# EAGLE design mostekH (EAGLE 6.3)
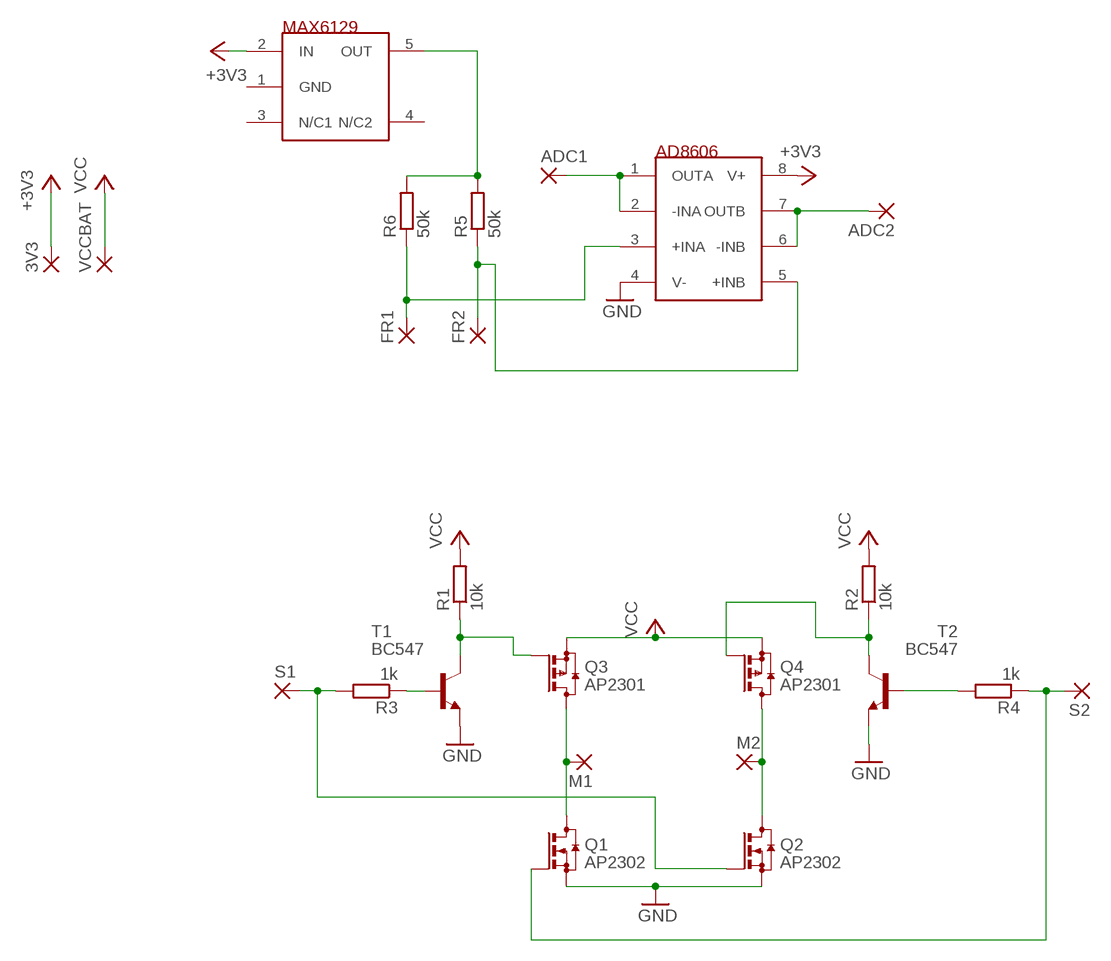
[diagram p0: schematic, sheet 1]

## Parts
3V3  2,54/0,8  [2,54/0,8]
ADC1  2,54/0,8  [2,54/0,8]
ADC2  2,54/0,8  [2,54/0,8]
FR1  2,54/0,8  [2,54/0,8]
FR2  2,54/0,8  [2,54/0,8]
M1  2,54/0,8  [2,54/0,8]
M2  2,54/0,8  [2,54/0,8]
Q1  AP2302  BSS123  [SOT23]
Q2  AP2302  BSS123  [SOT23]
Q3  AP2301  BSS84  [SOT23]
Q4  AP2301  BSS84  [SOT23]
R1  10k  R-EU_M0805  [M0805]
R2  10k  R-EU_M0805  [M0805]
R3  1k  R-EU_M0805  [M0805]
R4  1k  R-EU_M0805  [M0805]
R5  50k  R-EU_M0805  [M0805]
R6  50k  R-EU_M0805  [M0805]
S1  2,54/0,8  [2,54/0,8]
S2  2,54/0,8  [2,54/0,8]
T1  BC547  [TO92]
T2  BC547  [TO92]
U$1  AD8606  [SOIC8]
U$2  MAX6129  [SOT23-5L]
VCCBAT  2,54/0,8  [2,54/0,8]

## Nets
+3V3: 3V3.1(P) U$1.8(V+) U$2.2(IN)
GND: Q1.2(S) Q2.2(S) T1.1(E) T2.1(E) U$1.4(V-)
N$1: M1.1(P) Q1.3(D) Q3.3(D)
N$2: M2.1(P) Q2.3(D) Q4.3(D)
N$3: Q3.1(G) R1.1 T1.3(C)
N$4: Q4.1(G) R2.1 T2.3(C)
N$5: R4.2 T2.2(B)
N$6: FR1.1(P) R6.1 U$1.3(+INA)
N$7: Q2.1(G) R3.2 S1.1(P)
N$8: FR2.1(P) R5.1 U$1.5(+INB)
N$9: Q1.1(G) R4.1 S2.1(P)
N$10: R3.1 T1.2(B)
N$11: ADC1.1(P) U$1.1(OUTA) U$1.2(-INA)
N$12: ADC2.1(P) U$1.6(-INB) U$1.7(OUTB)
N$13: R5.2 R6.2 U$2.5(OUT)
VCC: Q3.2(S) Q4.2(S) R1.2 R2.2 VCCBAT.1(P)
Unconnected: U$2.1(GND) U$2.3(N/C1) U$2.4(N/C2)

## Library data of the parts
3V3 ADC1 ADC2 FR1 FR2 M1 M2 S1 S2 VCCBAT = wirepad:2,54/0,8: THROUGH-HOLE PAD
Q1 Q2 = transistor-small-signal:BSS123: N-CHANNEL MOS FET
Q3 Q4 = transistor-small-signal:BSS84: P-CHANNEL MOS FET
R1-R6 = rcl:R-EU_: RESISTOR, European symbol
T1 T2 = transistor:BC547: NPN TRANSISTOR
U$1 = ref-packages:AD8606: Dual, Precision, Low Noise, CMOS, Rail-to-Rail, Input/Output Operational Amplifiers Single-supply operation: 2.7 V to 5.5
U$2 = ref-packages:MAX6129

## Net classes
0 default: clearance 0.7 mm

## Board
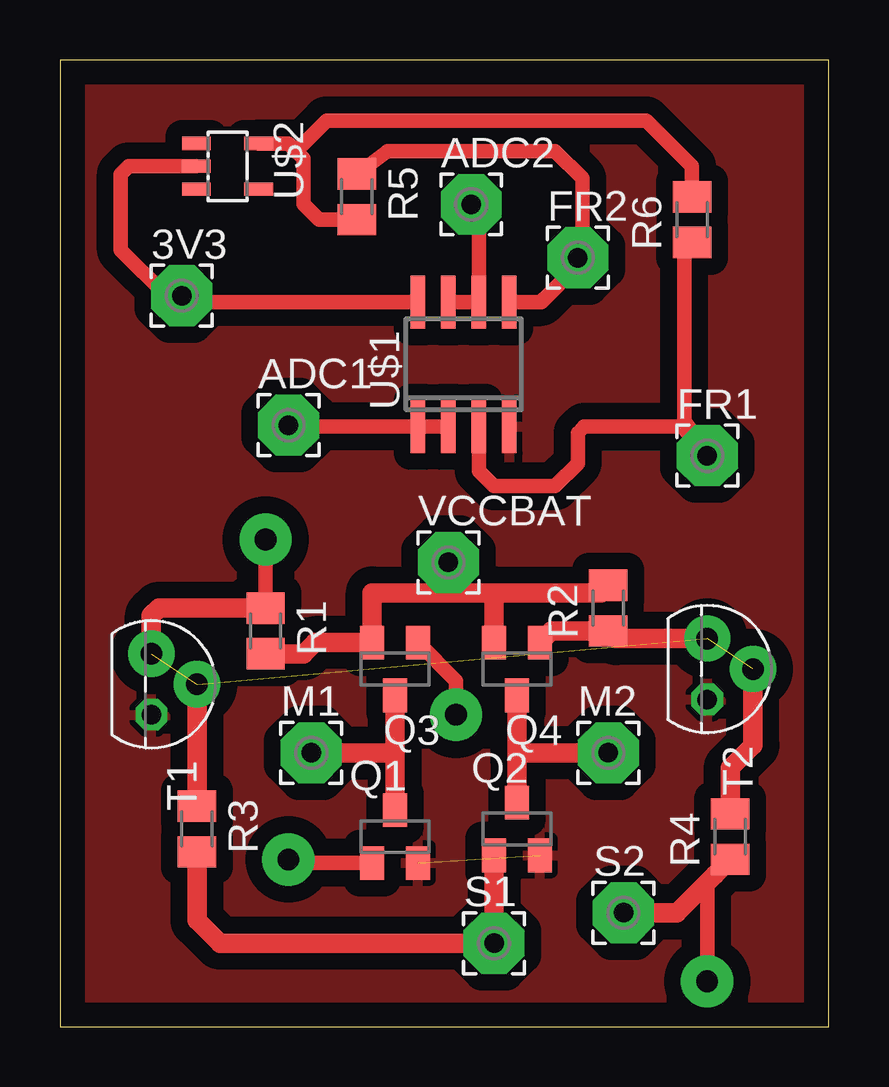
[diagram p1: board, top side]
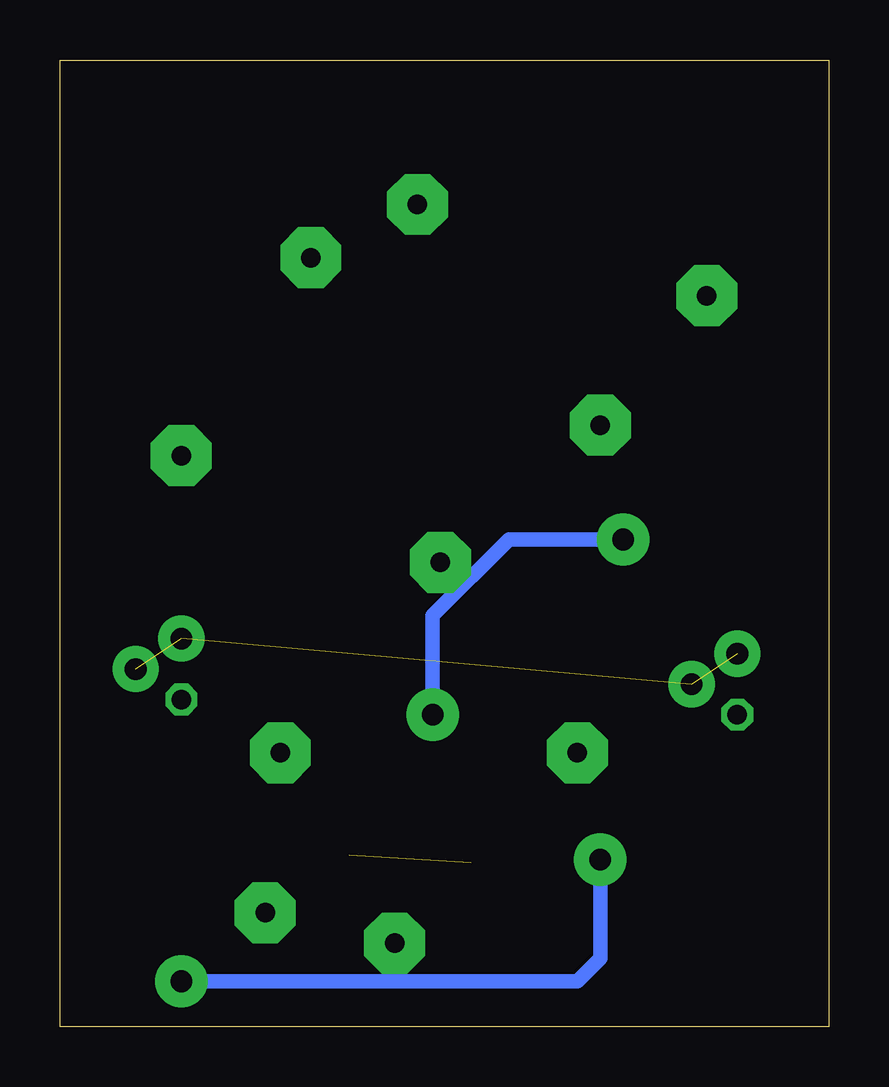
[diagram p2: board, bottom side, seen from below]

Size 32.05 x 40.31 mm. Coordinates in mm from the lower left corner, seen from the top.
Outline: 0,0 32.05,0 32.05,40.31 0,40.31 0,0
Copper layers (1*16): Top 0.035mm / dielectric 1.5mm / Bottom 0.035mm
Design rules "default": minimum track width 10mil, minimum drill 24mil, track to track 8mil, track to pad 8mil, pad to pad 8mil, via to via 8mil, smd to smd 8mil, copper to edge 40mil, drill to drill 8mil, minimum pad ring 10mil, minimum via ring 8mil, stop-mask expansion 4mil, vias tented up to drill 0mil, thermal gap 10mil

### Footprints (pad centres in the part's own frame; a part is rotated, then mirrored left to right if it is on the bottom)
2,54/0,8 = drill 0.813 pad 2.54 octagon: 1 0,0
SOT23 = smd 1 x 1.4: 1 -0.95,-1.1; 2 0.95,-1.1; 3 0,1.1
M0805 = smd 1.3 x 1.6: 1 -0.95,0; 2 0.95,0
TO92 = drill 0.813 octagon: 1 1.27,0; 2 0,1.905; 3 -1.27,0
SOIC8 = smd 0.6 x 2.2: 1 -1.905,-2.6; 2 -0.635,-2.6; 3 0.635,-2.6; 4 1.905,-2.6; 5 1.905,2.6; 6 0.635,2.6; 7 -0.635,2.6; 8 -1.905,2.6
SOT23-5L = smd 0.55 x 1.2: 1 -0.95,-1.3; 2 0,-1.3; 3 0.95,-1.3; 4 0.95,1.3; 5 -0.95,1.3

### Placement (x,y rotation side)
3V3  5.08,30.48 0 top
ADC1  9.53,25.08 0 top
ADC2  17.15,34.29 0 top
FR1  26.99,23.81 0 top
FR2  21.59,32.07 0 top
M1  10.48,11.43 0 top
M2  22.86,11.43 0 top
Q1  13.97,7.94 0 top
Q2  19.05,8.25 0 top
Q3  13.97,14.92 180 top
Q4  19.05,14.92 180 top
R1  8.57,16.51 270 top
R2  22.86,17.46 90 top
R3  5.71,8.25 270 top
R4  27.94,7.94 90 top
R5  12.38,34.61 270 top
R6  26.35,33.66 90 top
S1  18.1,3.49 0 top
S2  23.49,4.76 0 top
T1  3.81,14.29 270 top
T2  26.99,14.92 270 top
U$1  16.83,27.62 0 top
U$2  6.99,35.88 270 top
VCCBAT  16.19,19.37 0 top

### Tracks (layer width: path | path; a pad name or v marks a point on that pad's centre or on a via)
+3V3
  Top 0.61: U$1.8 5.34,30.22 3V3.1 | 3V3.1 | 3V3.1 4.45,30.48 2.54,32.38 2.54,35.56 2.86,35.88 U$2.2
GND  (1 unrouted)
  pour Top: -7.62,-6.99 43.18,-6.99 43.81,41.27 -6.98,41.27
N$1
  Top 0.813: Q3.3 13.97,11.75 13.97,11.43 | 13.97,11.43 Q1.3 | M1.1 13.97,11.43
N$2
  Top 0.813: Q4.3 19.05,11.43 | Q2.3 19.05,11.11 19.05,11.43 | M2.1 19.05,11.43
N$3  (via drill 0.9 pad 2.18)
  Top 0.61: R1.1 v8.57,20.32 | v16.51,13.02 16.51,14.43 Q3.1
  Top 0.813: T1.3 3.81,17.14 4.13,17.46 R1.1
  Bottom 0.61: v8.57,20.32 13.33,20.32 16.51,17.14 v16.51,13.02
N$4
  Top 0.813: T2.3 23.18,16.19 R2.1 20.49,16.51 Q4.1
N$5
  Top 0.813: R4.2 27.94,10.8 28.89,11.75 T2.2
N$6
  Top 0.61: U$1.3 17.46,23.18 18.1,22.54 20.64,22.54 21.59,23.5 21.59,24.77 21.84,25.02 25.97,25.02 26.03,25.09 26.03,32.38 R6.1
  Top 0.813: 26.03,25.09 FR1.1
N$7
  Top 0.813: S1.1 Q2.1 18.1,5.08 S1.1 | S1.1 6.67,3.49 5.71,4.44 R3.2
N$8
  Top 0.61: 21.91,32.07 FR2.1 21.59,31.75 20.06,30.22 U$1.5 20.05,30.22 20.18,30.36 20.2,30.36 21.77,31.93 21.77,35.38 20.64,36.51 13.65,36.51 R5.1
N$9  (via drill 0.9 pad 2.18)
  Top 0.61: Q1.1 9.67,6.84 v9.53,6.99 | v26.99,1.91 26.99,6.03 27.3,6.35
  Top 0.813: S2.1 25.71,4.76 27.3,6.35 R4.1
  Bottom 0.61: v9.53,6.99 9.53,2.86 10.48,1.91 v26.99,1.91
N$10
  Top 0.813: R3.1 T1.2
N$11
  Top 0.61: ADC1.1 9.59,25.02 U$1.1 U$1.2
N$12
  Top 0.61: ADC2.1 17.46,34.29 U$1.6 U$1.7
N$13
  Top 0.61: R5.2 10.79,33.66 10.16,34.29 10.16,36.2 9.84,36.51 | 9.84,36.51 9.53,36.83 U$2.5 | R6.2 26.35,35.88 24.45,37.78 11.11,37.78 9.84,36.51
N$15  (via drill 0.9 pad 1.93)  (3 unrouted)
  other vias: 3.81,15.56 5.71,14.29 28.89,14.92 26.99,16.19
VCC
  Top 0.813: 16.19,18.1 13.02,18.1 Q3.2 10.63,16.02 10.16,15.56 R1.2 | 16.19,18.1 18.1,18.1 | 18.1,18.1 Q4.2 | VCCBAT.1 16.19,18.1 | 18.1,18.1 22.55,18.1 R2.2